# Altium schematic sheet driver.SchDoc: 3-Phase MOSFET Driver
size A3; SheetNumber: 18; SheetTotal: 22
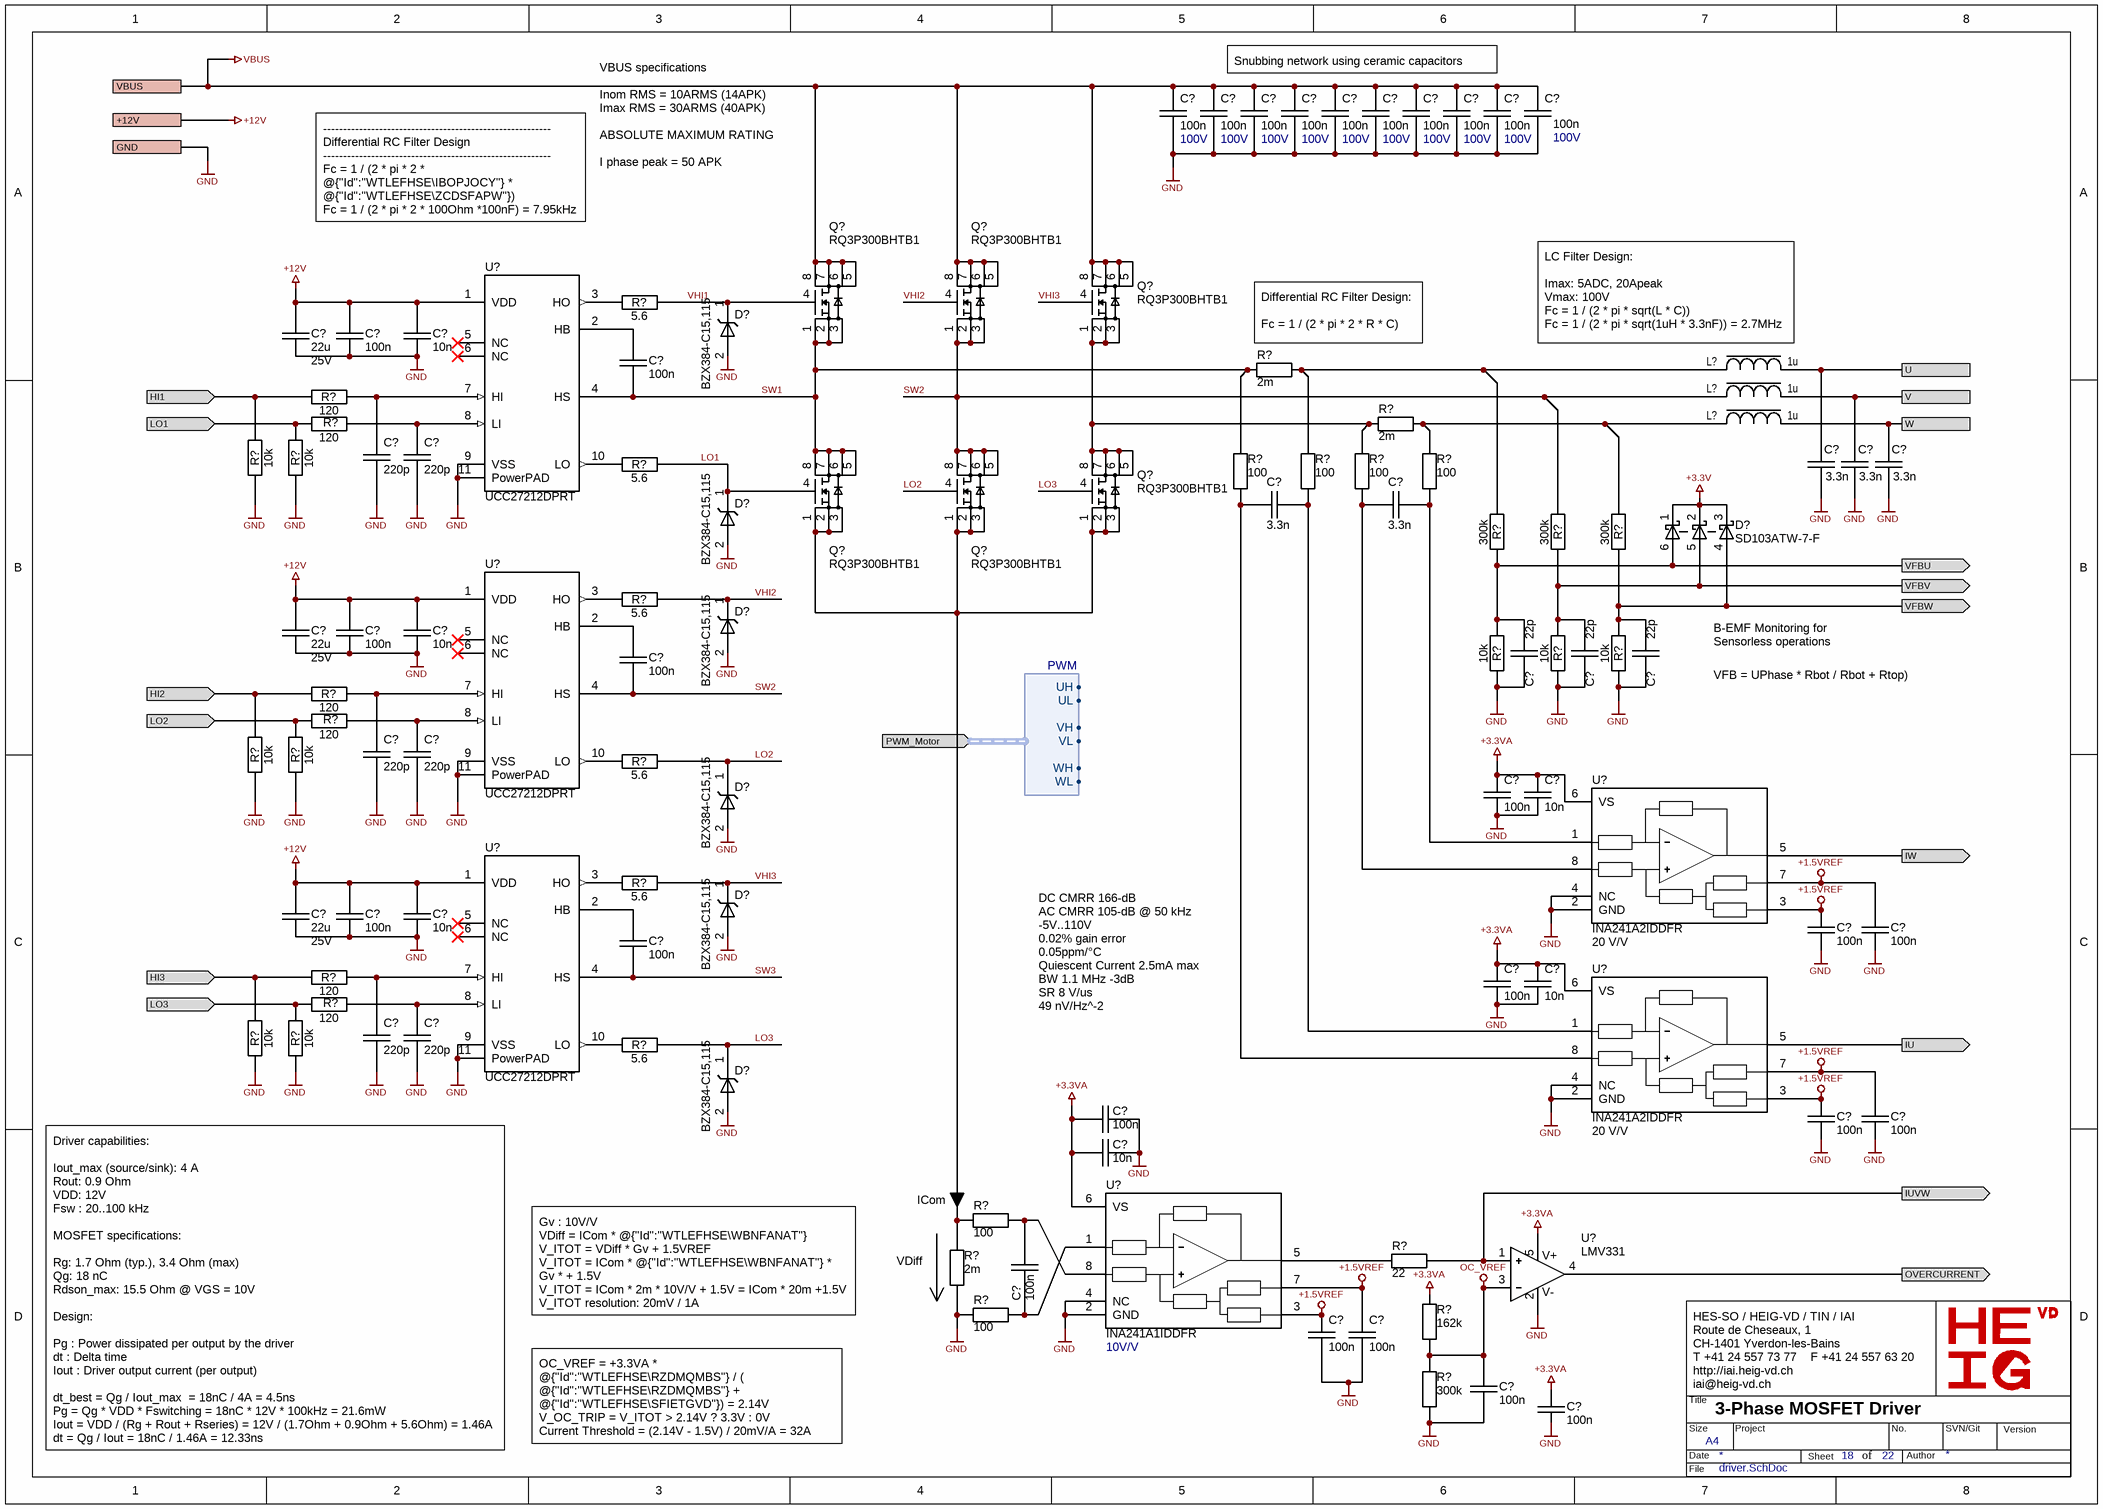
[diagram p0: driver.SchDoc]

## Parts
(Parts that share a designator on the sheet are numbered #1, #2 ... from top to bottom, then left to right.)
C?#1  100n  Voltage: 100V  [SM/C1206]
C?#2  100n  Voltage: 100V  [SM/C1206]
C?#3  100n  Voltage: 100V  [SM/C1206]
C?#4  100n  Voltage: 100V  [SM/C1206]
C?#5  100n  Voltage: 100V  [SM/C1206]
C?#6  100n  Voltage: 100V  [SM/C1206]
C?#7  100n  Voltage: 100V  [SM/C1206]
C?#8  100n  Voltage: 100V  [SM/C1206]
C?#9  100n  Voltage: 100V  [SM/C1206]
C?#10  100n  Voltage: 100V  [SM/C1206]
C?#11  10n  [SM/C0402]
C?#12  22u  Voltage: 25V  [SM/C0805]
C?#13  100n  [SM/C0402]
C?#14  100n  [SM/C0402]
C?#15  220p  [SM/C0402]
C?#16  220p  [SM/C0402]
C?#17  3.3n  [SM/C0402]
C?#18  3.3n  [SM/C0402]
C?#19  3.3n  [SM/C0402]
C?#20  3.3n  [SM/C0402]
C?#21  3.3n  [SM/C0402]
C?#22  10n  [SM/C0402]
C?#23  22u  Voltage: 25V  [SM/C0805]
C?#24  100n  [SM/C0402]
C?#25  100n  [SM/C0402]
C?#26  22p  [SM/C0402]
C?#27  22p  [SM/C0402]
C?#28  22p  [SM/C0402]
C?#29  220p  [SM/C0402]
C?#30  220p  [SM/C0402]
C?#31  10n  [SM/C0402]
C?#32  100n  [SM/C0402]
C?#33  10n  [SM/C0402]
C?#34  22u  Voltage: 25V  [SM/C0805]
C?#35  100n  [SM/C0402]
C?#36  100n  [SM/C0402]
C?#37  100n  [SM/C0402]
C?#38  100n  [SM/C0402]
C?#39  10n  [SM/C0402]
C?#40  100n  [SM/C0402]
C?#41  220p  [SM/C0402]
C?#42  220p  [SM/C0402]
C?#43  100n  [SM/C0402]
C?#44  100n  [SM/C0402]
C?#45  100n  [SM/C0402]
C?#46  10n  [SM/C0402]
C?#47  100n  [SM/C0402]
C?#48  100n  [SM/C0402]
C?#49  100n  [SM/C0402]
C?#50  100n  [SM/C0402]
C?#51  100n  [SM/C0402]
D?#1  BZX384-C15,115  [SODFL250X110-2N]
D?#2  BZX384-C15,115  [SODFL250X110-2N]
D?#3  SD103ATW-7-F  [SC70-6]
D?#4  BZX384-C15,115  [SODFL250X110-2N]
D?#5  BZX384-C15,115  [SODFL250X110-2N]
D?#6  BZX384-C15,115  [SODFL250X110-2N]
D?#7  BZX384-C15,115  [SODFL250X110-2N]
L?#1  1u  [PA5005.102NLT]
L?#2  1u  [PA5005.102NLT]
L?#3  1u  [PA5005.102NLT]
Q?#1  RQ3P300BHTB1  [RQ3P300BHTB1]
Q?#2  RQ3P300BHTB1  [RQ3P300BHTB1]
Q?#3  RQ3P300BHTB1  [RQ3P300BHTB1]
Q?#4  RQ3P300BHTB1  [RQ3P300BHTB1]
Q?#5  RQ3P300BHTB1  [RQ3P300BHTB1]
Q?#6  RQ3P300BHTB1  [RQ3P300BHTB1]
R?#1  5.6  [SM/R0402]
R?#2  2m  [SM/R1206]
R?#3  120  [SM/R0402]
R?#4  120  [SM/R0402]
R?#5  2m  [SM/R1206]
R?#6  10k  [SM/R0402]
R?#7  10k  [SM/R0402]
R?#8  5.6  [SM/R0402]
R?#9  100  [SM/R0402]
R?#10  100  [SM/R0402]
R?#11  100  [SM/R0402]
R?#12  100  [SM/R0402]
R?#13  300k  [SM/R0402]
R?#14  300k  [SM/R0402]
R?#15  300k  [SM/R0402]
R?#16  5.6  [SM/R0402]
R?#17  10k  [SM/R0402]
R?#18  10k  [SM/R0402]
R?#19  10k  [SM/R0402]
R?#20  120  [SM/R0402]
R?#21  120  [SM/R0402]
R?#22  10k  [SM/R0402]
R?#23  10k  [SM/R0402]
R?#24  5.6  [SM/R0402]
R?#25  5.6  [SM/R0402]
R?#26  120  [SM/R0402]
R?#27  120  [SM/R0402]
R?#28  10k  [SM/R0402]
R?#29  10k  [SM/R0402]
R?#30  5.6  [SM/R0402]
R?#31  100  [SM/R0402]
R?#32  2m  [SM/R1206]
R?#33  22  [SM/R0402]
R?#34  100  [SM/R0402]
R?#35  162k  [SM/R0402]
R?#36  300k  [SM/R0402]
U?#1  UCC27212DPRT  [PSON80P400X80_HS-11N]
U?#2  UCC27212DPRT  [PSON80P400X80_HS-11N]
U?#3  INA241A2IDDFR  Gain: 20 V/V  [SOT65P280X110-8N]
U?#4  UCC27212DPRT  [PSON80P400X80_HS-11N]
U?#5  INA241A2IDDFR  Gain: 20 V/V  [SOT65P280X110-8N]
U?#6  INA241A1IDDFR  Gain: 10V/V  [SOT65P280X110-8N]
U?#7  LMV331  [SOT23-5]

## Ports
+12V, GND, HI1 (in), HI2 (in), HI3 (in), IU (out), IUVW (out), IW (out), LO1 (in), LO2 (in), LO3 (in), OVERCURRENT (out), PWM_Motor (in, harness PWM), U, V, VBUS, VFBU (out), VFBV (out), VFBW (out), W

## Harnesses
PWM: UH, UL, VH, VL, WH, WL

## Nets
+1.5VREF: C?#37.2 C?#38.2 C?#44.2 C?#45.2 C?#48.2 C?#49.2 U?#3.3(REF2) U?#3.7(REF1) U?#5.3(REF2) U?#5.7(REF1) U?#6.3(REF2) U?#6.7(REF1)
+3.3V: D?#3.1(K) D?#3.2(K) D?#3.3(K)
+3.3VA: C?#31.1 C?#32.2 C?#39.1 C?#40.2 C?#43.2 C?#46.1 C?#51.2 R?#35.2 U?#3.6(VS) U?#5.6(VS) U?#6.6(VS) U?#7.5(V+)
+12V: C?#11.1 C?#12.2 C?#13.2 C?#22.1 C?#23.2 C?#24.2 C?#33.1 C?#34.2 C?#35.2 U?#1.1(VDD) U?#2.1(VDD) U?#4.1(VDD) ; port +12V
GND: C?#1.1 C?#2.1 C?#3.1 C?#4.1 C?#5.1 C?#6.1 C?#7.1 C?#8.1 C?#9.1 C?#10.1 C?#11.2 C?#12.1 C?#13.1 C?#15.1 C?#16.1 C?#17.1 C?#18.1 C?#19.1 C?#22.2 C?#23.1 C?#24.1 C?#26.1 C?#27.1 C?#28.1 C?#29.1 C?#30.1 C?#31.2 C?#32.1 C?#33.2 C?#34.1 C?#35.1 C?#37.1 C?#38.1 C?#39.2 C?#40.1 C?#41.1 C?#42.1 C?#43.1 C?#44.1 C?#45.1 C?#46.2 C?#48.1 C?#49.1 C?#50.1 D?#1.2(A) D?#2.2(A) D?#4.2(A) D?#5.2(A) D?#6.2(A) D?#7.2(A) R?#6.2 R?#7.2 R?#17.1 R?#18.1 R?#19.1 R?#22.2 R?#23.2 R?#28.2 R?#29.2 R?#32.1 R?#34.2 R?#36.1 U?#1.9(VSS) U?#1.11(PowerPAD) U?#2.9(VSS) U?#2.11(PowerPAD) U?#3.2(GND) U?#3.4(NC) U?#4.9(VSS) U?#4.11(PowerPAD) U?#5.2(GND) U?#5.4(NC) U?#6.2(GND) U?#6.4(NC) U?#7.2(V-) ; port GND
OC_VREF: C?#50.2 R?#35.1 R?#36.2 U?#7.3(IN-)
VBUS: C?#1.2 C?#2.2 C?#3.2 C?#4.2 C?#5.2 C?#6.2 C?#7.2 C?#8.2 C?#9.2 C?#10.2 Q?#1.5(D) Q?#1.6(D) Q?#1.7(D) Q?#1.8(D) Q?#2.5(D) Q?#2.6(D) Q?#2.7(D) Q?#2.8(D) Q?#3.5(D) Q?#3.6(D) Q?#3.7(D) Q?#3.8(D) ; port VBUS
HI1: R?#3.2 R?#6.1 ; port HI1
HI2: R?#20.2 R?#22.1 ; port HI2
HI3: R?#26.2 R?#28.1 ; port HI3
IU: U?#5.5(OUT) ; port IU
IUVW: R?#33.1 U?#7.1(IN+) ; port IUVW
IW: U?#3.5(OUT) ; port IW
LO1: D?#2.1(K) Q?#4.4(G) R?#8.1
LO1: R?#4.2 R?#7.1 ; port LO1  [a separate net that carries the same name]
LO2: D?#5.1(K) Q?#5.4(G) R?#24.1
LO2: R?#21.2 R?#23.1 ; port LO2  [a separate net that carries the same name]
LO3: D?#7.1(K) Q?#6.4(G) R?#30.1
LO3: R?#27.2 R?#29.1 ; port LO3  [a separate net that carries the same name]
OVERCURRENT: U?#7.4(OUT) ; port OVERCURRENT
SW1: C?#14.2 Q?#1.1(S) Q?#1.2(S) Q?#1.3(S) Q?#4.5(D) Q?#4.6(D) Q?#4.7(D) Q?#4.8(D) R?#2.1 R?#9.2 U?#1.4(HS)
SW2: C?#25.2 L?#2.1 Q?#2.1(S) Q?#2.2(S) Q?#2.3(S) Q?#5.5(D) Q?#5.6(D) Q?#5.7(D) Q?#5.8(D) R?#14.2 U?#2.4(HS)
SW3: C?#36.2 U?#4.4(HS)
U: C?#17.2 L?#1.2 ; port U
V: C?#18.2 L?#2.2 ; port V
VFBU: C?#26.2 D?#3.6(A) R?#13.1 R?#17.2 ; port VFBU
VFBV: C?#27.2 D?#3.5(A) R?#14.1 R?#18.2 ; port VFBV
VFBW: C?#28.2 D?#3.4(A) R?#15.1 R?#19.2 ; port VFBW
VHI1: D?#1.1(K) Q?#1.4(G) R?#1.2
VHI2: D?#4.1(K) Q?#2.4(G) R?#16.2
VHI3: D?#6.1(K) Q?#3.4(G) R?#25.2
W: C?#19.2 L?#3.2 ; port W
NetC?#14_1: C?#14.1 U?#1.2(HB)
NetC?#15_2: C?#15.2 R?#3.1 U?#1.7(HI)
NetC?#16_2: C?#16.2 R?#4.1 U?#1.8(LI)
NetC?#20_1: C?#20.1 R?#9.1 U?#5.8(IN+)
NetC?#20_2: C?#20.2 R?#10.1 U?#5.1(IN-)
NetC?#21_1: C?#21.1 R?#11.1 U?#3.8(IN+)
NetC?#21_2: C?#21.2 R?#12.1 U?#3.1(IN-)
NetC?#25_1: C?#25.1 U?#2.2(HB)
NetC?#29_2: C?#29.2 R?#20.1 U?#2.7(HI)
NetC?#30_2: C?#30.2 R?#21.1 U?#2.8(LI)
NetC?#36_1: C?#36.1 U?#4.2(HB)
NetC?#41_2: C?#41.2 R?#26.1 U?#4.7(HI)
NetC?#42_2: C?#42.2 R?#27.1 U?#4.8(LI)
NetC?#47_1: C?#47.1 R?#34.1 U?#6.1(IN-)
NetC?#47_2: C?#47.2 R?#31.1 U?#6.8(IN+)
NetL?#1_1: L?#1.1 R?#2.2 R?#10.2 R?#13.2
NetL?#3_1: L?#3.1 R?#5.2 R?#12.2 R?#15.2
NetQ?#3_1: Q?#3.1(S) Q?#3.2(S) Q?#3.3(S) Q?#6.5(D) Q?#6.6(D) Q?#6.7(D) Q?#6.8(D) R?#5.1 R?#11.2
NetQ?#4_1: Q?#4.1(S) Q?#4.2(S) Q?#4.3(S) Q?#5.1(S) Q?#5.2(S) Q?#5.3(S) Q?#6.1(S) Q?#6.2(S) Q?#6.3(S) R?#31.2 R?#32.2
NetR?#1_1: R?#1.1 U?#1.3(HO)
NetR?#8_2: R?#8.2 U?#1.10(LO)
NetR?#16_1: R?#16.1 U?#2.3(HO)
NetR?#24_2: R?#24.2 U?#2.10(LO)
NetR?#25_1: R?#25.1 U?#4.3(HO)
NetR?#30_2: R?#30.2 U?#4.10(LO)
NetR?#33_2: R?#33.2 U?#6.5(OUT)

Not connected (* = marked no-connect by the designer): C?#51 1; U?#1 5(NC)* 6(NC)*; U?#2 5(NC)* 6(NC)*; U?#4 5(NC)* 6(NC)*

## Notes on the sheet
- (near C?#3) Snubbing network using ceramic capacitors
- VBUS specifications
  Inom RMS = 10ARMS (14APK)
  Imax RMS = 30ARMS (40APK)
  ABSOLUTE MAXIMUM RATING
  I phase peak = 50 APK
- ---------------------------------------------------------
  Differential RC Filter Design
  ---------------------------------------------------------
  Fc = 1 / (2 * pi * 2 * @{"Id":"WTLEFHSE\IBOPJOCY"} * @{"Id":"WTLEFHSE\ZCDSFAPW"})
  Fc = 1 / (2 * pi * 2 * 100Ohm *100nF) = 7.95kHz
- (near R?#2) Differential RC Filter Design:
  Fc = 1 / (2 * pi * 2 * R * C)
- (near L?#1) LC Filter Design:
  Imax: 5ADC, 20Apeak
  Vmax: 100V
  Fc = 1 / (2 * pi * sqrt(L * C))
  Fc = 1 / (2 * pi * sqrt(1uH * 3.3nF)) = 2.7MHz
- VFB = UPhase * Rbot / Rbot + Rtop)
- B-EMF Monitoring for Sensorless operations
- DC CMRR 166-dB
  AC CMRR 105-dB @ 50 kHz
  -5V..110V
  0.02% gain error
  0.05ppm/°C
  Quiescent Current 2.5mA max
  BW 1.1 MHz -3dB
  SR 8 V/us
  49 nV/Hz^-2
- (near R?#32) VDiff
- (near R?#31) ICom
- Gv : 10V/V
  VDiff = ICom * @{"Id":"WTLEFHSE\WBNFANAT"}
  V_ITOT = VDiff * Gv + 1.5VREF
  V_ITOT = ICom * @{"Id":"WTLEFHSE\WBNFANAT"} * Gv * + 1.5V
  V_ITOT = ICom * 2m * 10V/V + 1.5V = ICom * 20m +1.5V
  V_ITOT resolution: 20mV / 1A
- Driver capabilities:
  Iout_max (source/sink): 4 A
  Rout: 0.9 Ohm
  VDD: 12V
  Fsw : 20..100 kHz
  MOSFET specifications:
  Rg: 1.7 Ohm (typ.), 3.4 Ohm (max)
  Qg: 18 nC
  Rdson_max: 15.5 Ohm @ VGS = 10V
  Design:
  Pg : Power dissipated per output by the driver
  dt : Delta time
  Iout : Driver output current (per output)
  dt_best = Qg / Iout_max  = 18nC / 4A = 4.5ns
  Pg = Qg * VDD * Fswitching = 18nC * 12V * 100kHz = 21.6mW
  Iout = VDD / (Rg + Rout + Rseries) = 12V / (1.7Ohm + 0.9Ohm + 5.6Ohm) = 1.46A
  dt = Qg / Iout = 18nC / 1.46A = 12.33ns
- OC_VREF = +3.3VA * @{"Id":"WTLEFHSE\RZDMQMBS"} / ( @{"Id":"WTLEFHSE\RZDMQMBS"} + @{"Id":"WTLEFHSE\SFIETGVD"}) = 2.14V
  V_OC_TRIP = V_ITOT > 2.14V ? 3.3V : 0V
  Current Threshold = (2.14V - 1.5V) / 20mV/A = 32A
- Labels drawn without touching a wire or pin: GND
- HES-SO / HEIG-VD / TIN / IAI
  Route de Cheseaux, 1
  CH-1401 Yverdon-les-Bains
  T +41 24 557 73 77    F +41 24 557 63 20
  http://iai.heig-vd.ch
  iai@heig-vd.ch
- Title
- Size
- Date
- A4
- Project
- Sheet
- of
- No.
- Author
- SVN/Git
- Version
- File

## Library data of the parts
C?#1-C?#10 = CAP CER 100NF 100V C0G 1206: 100 nF ±5% 100V Ceramic Capacitor C0G, NP0 1206 (3216 Metric); Dielectric: NPO; Supplier 1: Digi-Key; Supplier Part Number 1: 445-172677-1-ND; Value: 100n
C?#11 C?#22 C?#31 C?#33 C?#39 C?#46 = CAP CER 10NF 50V X7R 0402: 10 nF ±10% 50V Ceramic Capacitor X7R 0402 (1005 Metric); Voltage: 50V; Dielectric: X7R; Supplier 1: Digi-Key; Supplier Part Number 1: 1276-1028-1-ND; Value: 10n
C?#12 C?#23 C?#34 = CAP CER 22UF 25V X5R 0805: 22 µF ±20% 25V Ceramic Capacitor X5R 0805 (2012 Metric); Dielectric: X5R; Supplier 1: Digi-Key; Supplier Part Number 1: 490-14661-1-ND
C?#13 C?#14 C?#24 C?#25 C?#32 C?#35-C?#38 C?#40 C?#43-C?#45 C?#47-C?#51 = CAP CER 100NF 25V X5R 0402: 100 nF ±10% 25V Ceramic Capacitor X5R 0402 (1005 Metric); Voltage: 25V; Dielectric: X5R; Supplier 1: Digi-Key; Supplier Part Number 1: 1276-1043-1-ND; Value: 100n
C?#15 C?#16 C?#29 C?#30 C?#41 C?#42 = CAP CER 220PF 50V C0G/NP0 0402: 220 pF ±5% 50V Ceramic Capacitor C0G, NP0 0402 (1005 Metric); Dielectric: NPO; Voltage: 50V; Supplier 1: Digi-Key; Supplier Part Number 1: 1276-1059-1-ND; Value: 220p
C?#17-C?#21 = CAP CER 3.3NF 100V X8R 0402: 3.3 nF ±10% 100V Ceramic Capacitor X8R 0402 (1005 Metric); Voltage: 16V; Dielectric: X7R; Supplier 1: Digi-Key; Supplier Part Number 1: 445-15951-1-ND; Value: 3.3n
C?#26-C?#28 = CAP CER 22PF 50V C0G/NPO 0402: 22 pF ±2% 50V Ceramic Capacitor C0G, NP0 0402 (1005 Metric); Dielectric: NPO; Voltage: 50V; Supplier 1: Digi-Key; Supplier Part Number 1: 311-1652-1-ND; Value: 22p
D?#1 D?#2 D?#4-D?#7 = DIODE ZENER 15V 300MW SOD323: Zener Diode 15 V 300 mW ±5% Surface Mount SOD-323; Mounting: SMD; Supplier 1: Digi-Key; Supplier Part Number 1: 1727-4986-1-ND
D?#3 = SD103ATW-7-F: DIODE ARRAY SCHOTTKY 40V SOT363 / Diode Array 3 Independent Schottky 40 V 175mA Surface Mount 6-TSSOP, SC-88, SOT-363; Supplier 1: Digi-Key; Supplier Part Number 1: SD103ATW-FDICT-ND
L?#1-L?#3 = PA5005.102NLT: 1 µH Shielded Molded Inductor 20 A 4.52mOhm Max Nonstandard; Isat: 23A; Value: 1u; Supplier 1: Digi-Key; Supplier Part Number 1: 553-4098-1-ND
Q?#1-Q?#6 = RQ3P300BHTB1: N-Channel 100 V 39A (Ta) 2W (Ta) Surface Mount 8-HSMT (3.2x3); Supplier 1: Digi-Key; Supplier Part Number 1: 846-RQ3P300BHTB1CT-ND
R?#1 R?#8 R?#16 R?#24 R?#25 R?#30 = RES 5.6 OHM 5% 1/16W 0402: 5.6 Ohms ±5% 0.063W, 1/16W Chip Resistor 0402 (1005 Metric) Moisture Resistant Thick Film; Supplier 1: Digi-Key; Supplier Part Number 1: 311-5.6JRCT-ND; Value: 5.6
R?#2 R?#5 R?#32 = RES 0.002 OHM 1% 1W 1206: 2 mOhms ±1% 1W Chip Resistor 1206 (3216 Metric) Current Sense, Moisture Resistant Metal Element; Supplier 1: Digi-Key; Supplier Part Number 1: CSNL1206FT2L00CT-ND; Value: 2m
R?#3 R?#4 R?#20 R?#21 R?#26 R?#27 = RES 120 OHM 1% 1/16W 0402: 120 Ohms ±1% 0.063W, 1/16W Chip Resistor 0402 (1005 Metric) Moisture Resistant Thick Film; Supplier 1: Digi-Key; Supplier Part Number 1: 311-120LRCT-ND; Value: 120
R?#6 R?#7 R?#17-R?#19 R?#22 R?#23 R?#28 R?#29 = RES 10K OHM 1% 1/16W 0402: 10 kOhms ±1% 0.063W, 1/16W Chip Resistor 0402 (1005 Metric) Moisture Resistant Thick Film; Supplier 1: Digi-Key; Supplier Part Number 1: 1276-3431-1-ND; Value: 10k
R?#9-R?#12 R?#31 R?#34 = RES 100 OHM 1% 1/16W 0402: 100 Ohms ±1% 0.063W, 1/16W Chip Resistor 0402 (1005 Metric) Moisture Resistant Thick Film; Supplier 1: Digi-Key; Supplier Part Number 1: 13-RC0402FR-13100RLCT-ND; Value: 100
R?#13-R?#15 R?#36 = RES 300K OHM 1% 1/16W 0402: 300 kOhms ±1% 0.063W, 1/16W Chip Resistor 0402 (1005 Metric) Moisture Resistant Thick Film; Value: 300k; Supplier 1: Digi-Key; Supplier Part Number 1: 311-300KLRCT-ND
R?#33 = RES 22 OHM 1% 1/16W 0402: 22 Ohms ±1% 0.063W, 1/16W Chip Resistor 0402 (1005 Metric) Moisture Resistant Thick Film; Value: 22; Supplier 1: Digi-Key; Supplier Part Number 1: 311-22.0LRCT-ND
R?#35 = RES 162K OHM 1% 1/16W 0402: 162 kOhms ±1% 0.063W, 1/16W Chip Resistor 0402 (1005 Metric) Moisture Resistant Thick Film; Supplier 1: Digi-Key; Supplier Part Number 1: YAG2370CT-ND; Value: 162k
U?#1 U?#2 U?#4 = UCC27212: Half-Bridge Gate Driver IC Non-Inverting 10-WSON (4x4); Supplier 1: Digi-Key; Supplier Part Number 1: 296-47091-1-ND
U?#3 U?#5 = INA241A2IDDFR: Current Sense Amplifier 1 Circuit Single-Ended TSOT-23-8; Supplier 1: Digi-Key; Supplier Part Number 1: 296-INA241A2IDDFRDKR-ND
U?#6 = INA241A1IDDFR: Current Sense Amplifier 10V/V  1 Circuit Single-Ended TSOT-23-8; Supplier 1: Digi-Key; Supplier Part Number 1: 296-INA241A1IDDFRCT-ND
U?#7 = LM331: Comparator General Purpose CMOS, Open-Collector, TTL SOT-23-5; Supplier 1: Digi-Key; Supplier Part Number 1: 296-6633-1-ND